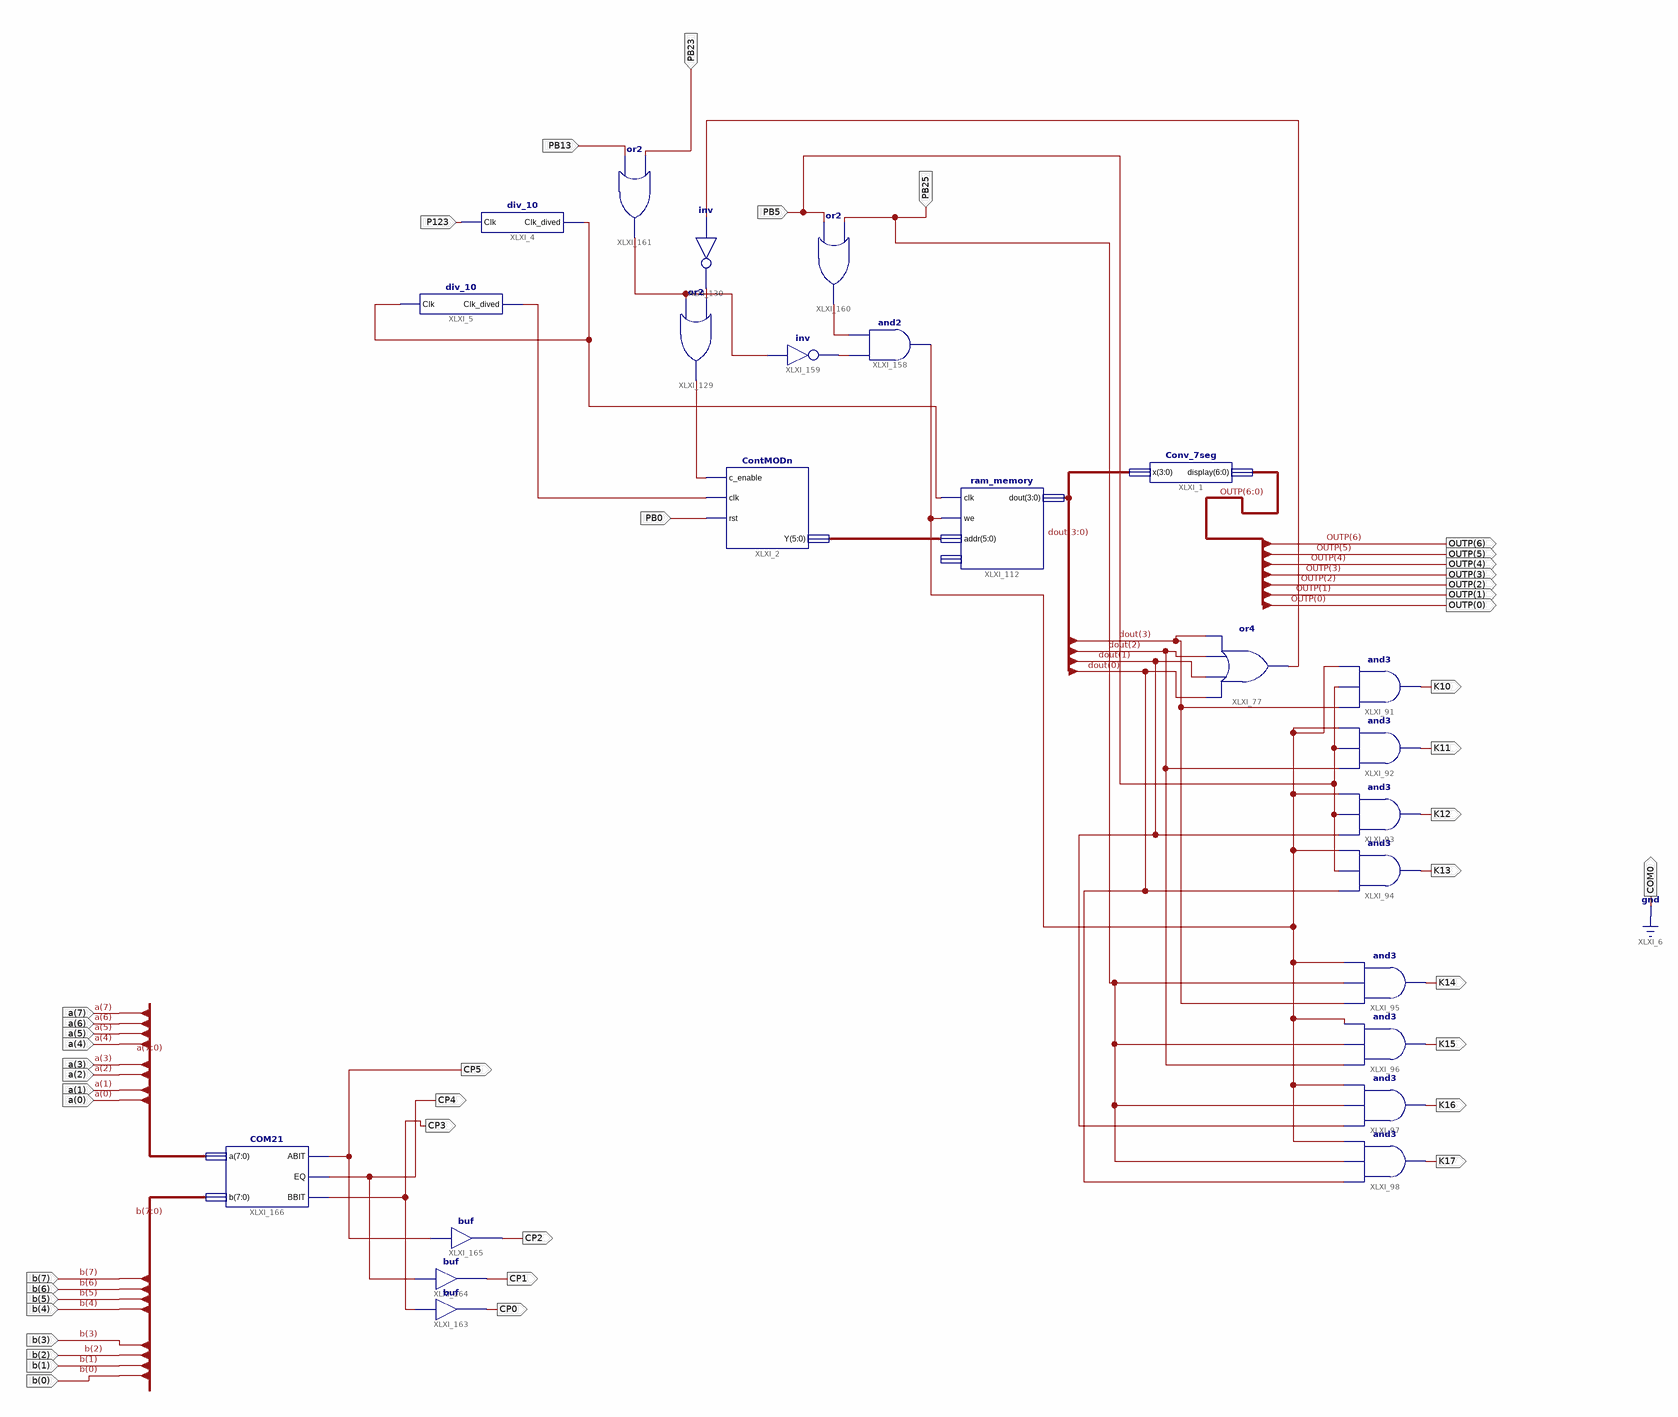
[diagram p0: schematic sheet 1]
// Xilinx ISE schematic Main.sch (spartan6) as structural Verilog: 24 symbols, 44 ports
module Main (
  input  PB0,
  input  PB13,
  input  P123,
  input  PB5,
  input  PB23,
  input  PB25,
  input  [7:0] b,
  input  [7:0] a,
  output [6:0] OUTP,
  output K10,
  output K11,
  output K12,
  output K13,
  output K14,
  output K15,
  output K16,
  output K17,
  output COM0,
  output CP2,
  output CP5,
  output CP0,
  output CP1,
  output CP3,
  output CP4
);

  wire SW0, XLXN_17, XLXN_301, XLXN_303, XLXN_307, XLXN_389, XLXN_409, XLXN_412, XLXN_417;
  wire [3:0] dout;
  wire [5:0] XLXN_1;

  div_10 XLXI_5 (.Clk(XLXN_17), .Clk_dived(XLXN_389));
  div_10 XLXI_4 (.Clk(P123), .Clk_dived(XLXN_17));
  ContMODn XLXI_2 (.c_enable(XLXN_303), .clk(XLXN_389), .rst(PB0), .Y(XLXN_1));
  Conv_7seg XLXI_1 (.x(dout), .display(OUTP));
  or XLXI_77 (XLXN_301, dout[0], dout[1], dout[2], dout[3]);
  and XLXI_98 (K17, dout[0], PB25, SW0);
  and XLXI_97 (K16, dout[1], PB25, SW0);
  and XLXI_96 (K15, dout[2], PB25, SW0);
  and XLXI_95 (K14, dout[3], PB25, SW0);
  and XLXI_91 (K10, dout[3], PB5, SW0);
  and XLXI_92 (K11, dout[2], PB5, SW0);
  and XLXI_93 (K12, dout[1], PB5, SW0);
  and XLXI_94 (K13, dout[0], PB5, SW0);
  ram_memory XLXI_112 (.clk(XLXN_17), .we(SW0), .addr(XLXN_1), .dout(dout));  // open: din
  or XLXI_129 (XLXN_303, XLXN_417, XLXN_307);
  not XLXI_130 (XLXN_307, XLXN_301);
  and XLXI_158 (SW0, XLXN_409, XLXN_412);
  not XLXI_159 (XLXN_409, XLXN_417);
  or XLXI_160 (XLXN_412, PB5, PB25);
  or XLXI_161 (XLXN_417, PB13, PB23);
  buf XLXI_165 (CP2, CP5);
  buf XLXI_164 (CP1, CP4);
  buf XLXI_163 (CP0, CP3);
  COM21 XLXI_166 (.a(a), .b(b), .ABIT(CP5), .EQ(CP4), .BBIT(CP3));

  assign COM0 = 1'b0;
endmodule
